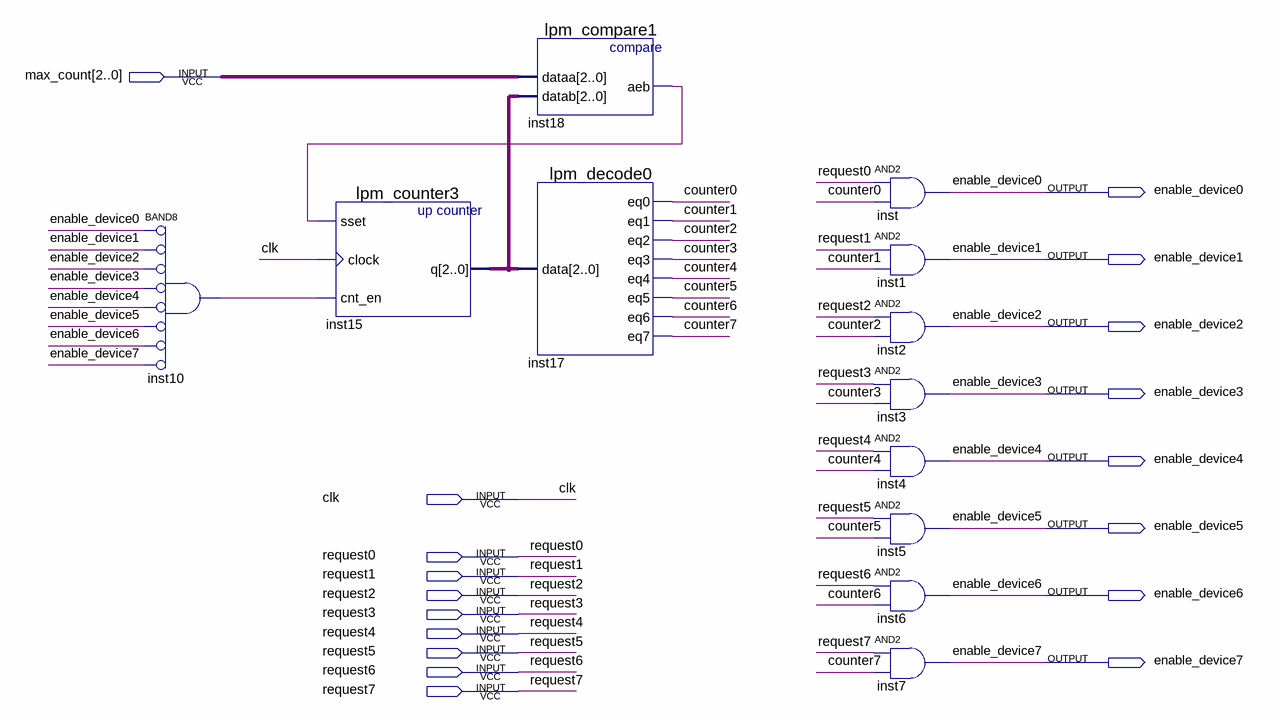
[diagram p0: schematic sheet]
// Quartus schematic control_device.bdf as structural Verilog: 12 symbols, 18 pins
module control_device (
  input  [2:0] max_count,
  input  clk,
  input  request0,
  input  request1,
  input  request2,
  input  request3,
  input  request4,
  input  request5,
  input  request6,
  input  request7,
  output enable_device0,
  output enable_device1,
  output enable_device2,
  output enable_device3,
  output enable_device4,
  output enable_device5,
  output enable_device6,
  output enable_device7
);

  wire counter0, counter1, counter2, counter3, counter4, counter5, counter6, counter7, inst10_out, inst18_aeb;
  wire [2:0] inst15_q;

  and inst10 (inst10_out, ~enable_device0, ~enable_device1, ~enable_device2, ~enable_device3, ~enable_device4, ~enable_device5, ~enable_device6, ~enable_device7);  // BAND8
  lpm_counter3 inst15 (.sset(inst18_aeb), .clock(clk), .cnt_en(inst10_out), .q(inst15_q));
  lpm_compare1 inst18 (.dataa(max_count), .datab(inst15_q), .aeb(inst18_aeb));
  lpm_decode0 inst17 (
    .data(inst15_q), .eq0(counter0), .eq1(counter1), .eq2(counter2), .eq3(counter3), .eq4(counter4),
    .eq5(counter5), .eq6(counter6), .eq7(counter7));
  and inst (enable_device0, request0, counter0);
  and inst1 (enable_device1, request1, counter1);
  and inst2 (enable_device2, request2, counter2);
  and inst3 (enable_device3, request3, counter3);
  and inst4 (enable_device4, request4, counter4);
  and inst5 (enable_device5, request5, counter5);
  and inst6 (enable_device6, request6, counter6);
  and inst7 (enable_device7, request7, counter7);
endmodule
